# Altium project ZET6_BEEP_LCD.PrjPcb
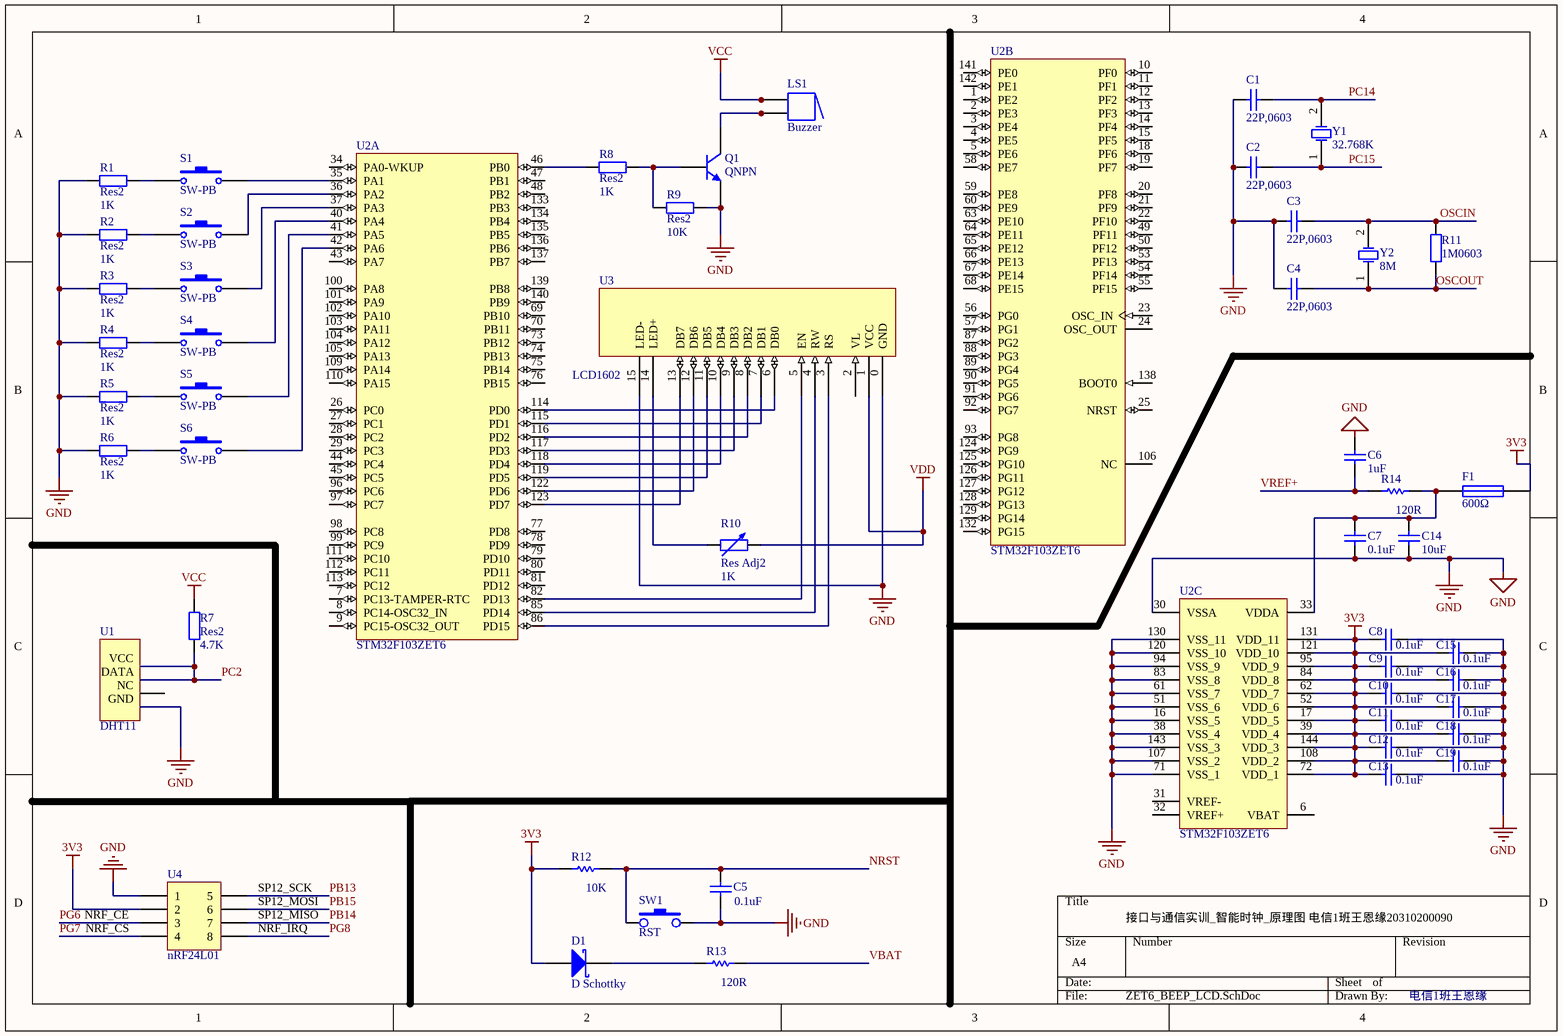
[diagram p0: ZET6_BEEP_LCD.SchDoc]
1 sheet, 50 parts. Net scope: global (net labels, ports and power ports of the same name join across sheets).

## Sheet ZET6_BEEP_LCD.SchDoc
size A4

### Parts
C1  22P,0603  [C 0603]
C2  22P,0603  [C 0603]
C3  22P,0603  [C 0603]
C4  22P,0603  [C 0603]
C5  0.1uF  [C 0603]
C6  1uF  [C 0603]
C7  0.1uF  [C 0603]
C8  0.1uF  [C 0603]
C9  0.1uF  [C 0603]
C10  0.1uF  [C 0603]
C11  0.1uF  [C 0603]
C12  0.1uF  [C 0603]
C13  0.1uF  [C 0603]
C14  10uF  [C 0603]
C15  0.1uF  [C 0603]
C16  0.1uF  [C 0603]
C17  0.1uF  [C 0603]
C18  0.1uF  [C 0603]
C19  0.1uF  [C 0603]
D1  D Schottky  [SMB]
F1  600Ω  [PIN-W2/E2.8]
LS1  Buzzer  [ABSM-1574]
Q1  QNPN  [SOT-23B_N]
R1  Res2  value 1K  [AXIAL-0.4]
R2  Res2  value 1K  [AXIAL-0.4]
R3  Res2  value 1K  [AXIAL-0.4]
R4  Res2  value 1K  [AXIAL-0.4]
R5  Res2  value 1K  [AXIAL-0.4]
R6  Res2  value 1K  [AXIAL-0.4]
R7  Res2  value 4.7K  [AXIAL-0.4]
R8  Res2  value 1K  [AXIAL-0.4]
R9  Res2  value 10K  [AXIAL-0.4]
R10  Res Adj2  value 1K  [AXIAL-0.6]
R11  1M0603  [R 0603]
R12  value 10K  [AXIAL-0.5]  (hidden comment: Res Semi)
R13  value 120R  [AXIAL-0.5]  (hidden comment: Res Semi)
R14  value 120R  [AXIAL-0.5]  (hidden comment: Res Semi)
S1  SW-PB  [SPST-2]
S2  SW-PB  [SPST-2]
S3  SW-PB  [SPST-2]
S4  SW-PB  [SPST-2]
S5  SW-PB  [SPST-2]
S6  SW-PB  [SPST-2]
SW1  RST  [TSW SMD-3*6*2.5]
U1  DHT11
U2  STM32F103ZET6  [STM-LQFP144_N]  (parts A,B,C of 3)
U3  LCD1602  [LCD 1602]
U4  nRF24L01
Y1  32.768K  [XTAL-49S DIP]
Y2  8M  [XTAL-49S DIP]

### Nets
3V3: C8.1 C9.1 C10.1 C11.1 C12.1 C13.1 C15.1 C16.1 C17.1 C18.1 C19.1 D1.1(A) F1.2 R12.1 U2.17(VDD_5) U2.39(VDD_4) U2.52(VDD_6) U2.62(VDD_7) U2.72(VDD_1) U2.84(VDD_8) U2.95(VDD_9) U2.108(VDD_2) U2.121(VDD_10) U2.131(VDD_11) U2.144(VDD_3) U4.?2(2)
GND: C1.2 C2.2 C3.2 C4.2 C5.1 C6.2 C7.1 C8.2 C9.2 C10.2 C11.2 C12.2 C13.2 C14.1 C15.2 C16.2 C17.2 C18.2 C19.2 Q1.3(E) R1.2 R2.2 R3.2 R4.2 R5.2 R6.2 R9.1 SW1.2 U1.GND U2.16(VSS_5) U2.30(VSSA) U2.38(VSS_4) U2.51(VSS_6) U2.61(VSS_7) U2.71(VSS_1) U2.83(VSS_8) U2.94(VSS_9) U2.107(VSS_2) U2.120(VSS_10) U2.130(VSS_11) U2.143(VSS_3) U3.0(GND) U3.15(LED-) U4.?1(1)
VCC: LS1.1 LS1.1A R7.1
VDD: R10.2 U3.1(VCC)
NRST: C5.2 R12.2 SW1.1
OSCIN: C3.1 R11.2 Y2.2(OSC2)
OSCOUT: C4.1 R11.1 Y2.1(OSC1)
PB13: U4.SP12_SCK(5)
PB14: U4.SP12_MISO(7)
PB15: U4.SP12_MOSI(6)
PC2: R7.2 U1.DATA U1.VCC
PC14: C1.1 Y1.2(OSC2)
PC15: C2.1 Y1.1(OSC1)
PG6: U4.NRF_CE(3)
PG7: U4.NRF_CS(4)
PG8: U4.NRF_IRQ(8)
VBAT: R13.2
VREF+: C6.1 R14.1
NetC7_2: C7.2 C14.2 F1.1 R14.2 U2.33(VDDA)
NetD1_2: D1.2(K) R13.1
NetLS1_2: LS1.2 LS1.2A Q1.1(C)
NetQ1_2: Q1.2(B) R8.1 R9.2
NetR1_1: R1.1 S1.1
NetR2_1: R2.1 S2.1
NetR3_1: R3.1 S3.1
NetR4_1: R4.1 S4.1
NetR5_1: R5.1 S5.1
NetR6_1: R6.1 S6.1
NetR8_2: R8.2 U2.46(PB0)
NetR10_1: R10.1 U3.14(LED+)
NetS1_2: S1.2 U2.35(PA1)
NetS2_2: S2.2 U2.36(PA2)
NetS3_2: S3.2 U2.37(PA3)
NetS4_2: S4.2 U2.40(PA4)
NetS5_2: S5.2 U2.41(PA5)
NetS6_2: S6.2 U2.42(PA6)
NetU2_82: U2.82(PD13) U3.5(EN)
NetU2_85: U2.85(PD14) U3.4(RW)
NetU2_86: U2.86(PD15) U3.3(RS)
NetU2_114: U2.114(PD0) U3.6(DB0)
NetU2_115: U2.115(PD1) U3.7(DB1)
NetU2_116: U2.116(PD2) U3.8(DB2)
NetU2_117: U2.117(PD3) U3.9(DB3)
NetU2_118: U2.118(PD4) U3.10(DB4)
NetU2_119: U2.119(PD5) U3.11(DB5)
NetU2_122: U2.122(PD6) U3.12(DB6)
NetU2_123: U2.123(PD7) U3.13(DB7)

Not connected (* = marked no-connect by the designer): U1 NC; U2 1(PE2) 2(PE3) 3(PE4) 4(PE5) 5(PE6) 6(VBAT) 7(PC13-TAMPER-RTC) 8(PC14-OSC32_IN) 9(PC15-OSC32_OUT) 10(PF0) 11(PF1) 12(PF2) 13(PF3) 14(PF4) 15(PF5) 18(PF6) 19(PF7) 20(PF8) 21(PF9) 22(PF10) 23(OSC_IN) 24(OSC_OUT) 25(NRST) 26(PC0) 27(PC1) 28(PC2) 29(PC3) 31(VREF-) 32(VREF+) 34(PA0-WKUP) 43(PA7) 44(PC4) 45(PC5) 47(PB1) 48(PB2) 49(PF11) 50(PF12) 53(PF13) 54(PF14) 55(PF15) 56(PG0) 57(PG1) 58(PE7) 59(PE8) 60(PE9) 63(PE10) 64(PE11) 65(PE12) 66(PE13) 67(PE14) 68(PE15) 69(PB10) 70(PB11) 73(PB12) 74(PB13) 75(PB14) 76(PB15) 77(PD8) 78(PD9) 79(PD10) 80(PD11) 81(PD12) 87(PG2) 88(PG3) 89(PG4) 90(PG5) 91(PG6) 92(PG7) 93(PG8) 96(PC6) 97(PC7) 98(PC8) 99(PC9) 100(PA8) 101(PA9) 102(PA10) 103(PA11) 104(PA12) 105(PA13) 106(NC) 109(PA14) 110(PA15) 111(PC10) 112(PC11) 113(PC12) 124(PG9) 125(PG10) 126(PG11) 127(PG12) 128(PG13) 129(PG14) 132(PG15) 133(PB3) 134(PB4) 135(PB5) 136(PB6) 137(PB7) 138(BOOT0) 139(PB8) 140(PB9) 141(PE0) 142(PE1); U3 2(VL)

### Notes on the sheet
- 接口与通信实训_智能时钟_原理图 电信1班王恩缘20310200090
- 电信1班王恩缘

### Library data of the parts
C1-C4 = Cap: Capacitor; Value: 104; Published: 8-Jun-2000; LatestRevisionDate: 17-Jul-2002; LatestRevisionNote: Re-released for DXP Platform.; Publisher: Altium Limited
C5-C19 = Cap: Value: 104; Published: 8-Jun-2000; LatestRevisionDate: 17-Jul-2002; LatestRevisionNote: Re-released for DXP Platform.; Publisher: Altium Limited
D1 = D Schottky: Schottky Diode; Published: 8-Jun-2000; LatestRevisionDate: 17-Jul-2002; LatestRevisionNote: Re-released for DXP Platform.; PackageReference: SMB; Publisher: Altium Limited; PackageDescription: DO-214-AA/SMB; 2 C-Bend Leads; Body 5.3 x 3.6 mm, inc. leads (LxW); Code_JEDEC: DO-214-AA
F1 = Fuse 1: Fuse; Published: 8-Jun-2000; LatestRevisionDate: 17-Jul-2002; LatestRevisionNote: Re-released for DXP Platform.; PackageReference: PIN-W2/E2.8; Publisher: Altium Limited; PackageDescription: Thru-Hole; 2 Leads
LS1 = Buzzer: Magnetic Transducer Buzzer; Published: 24-Mar-1999; LatestRevisionDate: 17-Dec-2003; LatestRevisionNote: Schematic revised, PCB Footprint replaced.; DatasheetVersion: 17-Dec-2003; PackageReference: ABSM-1574; Publisher: Altium Limited; PackageDescription: Magnetic Transducer Buzzer; ComponentLink1Description: Manufacturer Link; ComponentLink1URL: http://www.megastar.com/linecard/buzzmode/index.php
Q1 = QNPN: NPN Bipolar Transistor; Published: 8-Jun-2000; LatestRevisionDate: 29-May-2009; LatestRevisionNote: IPC-7351 Footprint Added.; PackageVersion: Aug-1999; PackageReference: SOT-23B; Publisher: Altium Limited; PackageDescription: 3-Pin SOT-23 Package 0.95 mm Pitch, 2.4 mm Lead Span
R1-R9 R11 = Res2: Resistor; Published: 8-Jun-2000; LatestRevisionDate: 17-Jul-2002; LatestRevisionNote: Re-released for DXP Platform.; Publisher: Altium Limited
  R1-R9: PackageReference: AXIAL-0.4; PackageDescription: Axial Device, Thru-Hole; 2 Leads; 0.4 in Pin Spacing
R10 = Res Adj2: Variable Resistor; Set Position: 0.5; Published: 8-Jun-2000; LatestRevisionDate: 17-Jul-2002; LatestRevisionNote: Re-released for DXP Platform.; PackageReference: AXIAL-0.6; Publisher: Altium Limited; PackageDescription: Axial Device, Thru-Hole; 2 Leads; 0.6 in Pin Spacing
R12-R14 = Res Semi: Semiconductor Resistor; Published: 8-Jun-2000; LatestRevisionDate: 17-Jul-2002; LatestRevisionNote: Re-released for DXP Platform.; PackageReference: AXIAL-0.5; Publisher: Altium Limited; PackageDescription: Axial Device, Thru-Hole; 2 Leads; 0.5 in Pin Spacing
S1-S6 = SW-PB: Switch; Published: 24-Mar-1999; LatestRevisionDate: 17-Jul-2002; LatestRevisionNote: Re-released for DXP Platform.; PackageReference: SPST-2; Publisher: Altium Limited; PackageDescription: Switch; 2 Leads
SW1 = SW-PB_V
U2 = STM32F103ZET6: ARM Cortex-M3 32-bit MCU, 512 KB Flash, 64 KB Internal RAM, 112 I/Os, 144-pin LQFP, -40 to 85 degC, Tray; A/D Converter: 3x12-bit (21 Channel); D/A Converter: 2x12-bit (2 Channel); FLASH Size (Prog) (kB): 512; I/Os (High Current): 112; Internal RAM Size (kB): 64; Operating Frequency(F) (Processor speed) (MHz): 72; Supply Voltage(Vcc) min (V): 2; DatasheetVersion: Rev. 8; PackageVersion: Rev. 4, 06/2013; PackageReference: LQFP144; PackageDescription: 144-Pin Low Profile Quad Flat Package, 20 x 20 mm Body, 0.5 mm Pitch; Supplier 1: Digi-Key; Supplier Part Number 1: 497-6442-ND; Supplier 2: Farnell; Supplier Part Number 2: 1624145; Supplier 3: Newark; Supplier Part Number 3: 57P1270; Supplier 4: Mouser; Supplier Part Number 4: 511-STM32F103ZET6; Core: ARM Cortex-M3; Packing: Tray; Mounting Technology: Surface Mount; PartNumber: STM32F103ZET6; ComponentLink1Description: Manufacturer URL; ComponentLink1URL: http://www.st.com/web/en/home.html; ComponentLink2Description: Datasheet; ComponentLink2URL: http://www.st.com/st-web-ui/static/active/en/resource/technical/document/datasheet/CD00191185.pdf; ComponentLink3Description: Package Specification; ComponentLink3URL: http://www.st.com/st-web-ui/static/active/en/resource/technical/document/datasheet/DM00037051.pdf
Y1 Y2 = XTAL: Crystal Oscillator; Published: 8-Jun-2000; LatestRevisionDate: 17-Jul-2002; LatestRevisionNote: Re-released for DXP Platform.; Publisher: Altium Limited